# Altium project DiverStep_Test.PrjPCB
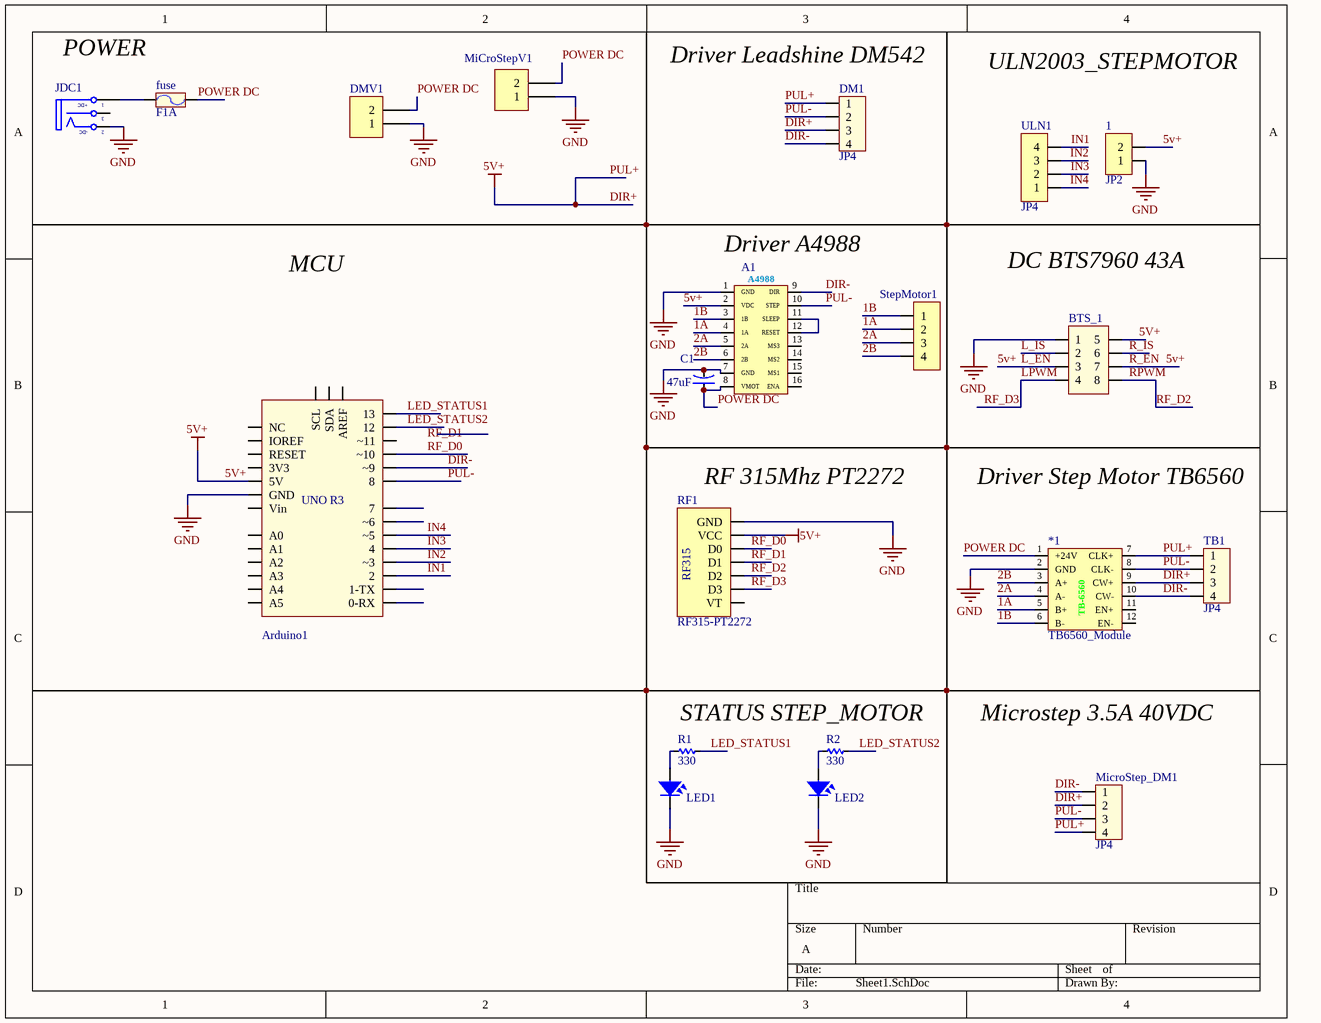
[diagram p0: Sheet1.SchDoc]
1 sheet, 20 parts. Net scope: global (net labels, ports and power ports of the same name join across sheets).
Board file: PCB1.PcbDoc

## Sheet Sheet1.SchDoc
size A

### Parts
1  JP2  [JP2-D1T]
*1  TB6560_Module  [TB6560_Module]
A1  A4988  [A4988]  (value not drawn)
Arduino1  Arduino Uno R3  [UNO_R3_NoCircle]  (value not drawn)
BTS_1  Connector 4x2  [JP4x2]  (value not drawn)
C1  47uF  [CA-ALU-2.54]
DM1  JP4  [CON4]
DMV1  KF2  [KF2-5.08]  (value not drawn)
fuse  F1A  [Fuse1]
JDC1  Jac DC  [DC0]  (value not drawn)
LED1  LED  [LED-3MM-RED]  (value not drawn)
LED2  LED  [LED-3MM-RED]  (value not drawn)
MicroStep_DM1  JP4  [CON4]
MiCroStepV1  KF2  [KF2-5.08]  (value not drawn)
R1  330  [RES-1/4W-SMALL]
R2  330  [RES-1/4W-SMALL]
RF1  RF315-PT2272  [RF_315]
StepMotor1  JP4  [JP4-C1T]  (value not drawn)
TB1  JP4  [CON4]
ULN1  JP4  [JP4-D1T]

### Nets
5V+: 1.2 *1.7(CLK+) *1.9(CW+) A1.2(VDC) Arduino1.5V BTS_1.3 BTS_1.5 BTS_1.7 DM1.1 DM1.3 MicroStep_DM1.2 MicroStep_DM1.4 RF1.6(VCC) TB1.1 TB1.3  [also labelled DIR+, L_EN, PUL+, R_EN]
GND: 1.1 *1.2(GND) A1.1(GND) A1.7(GND) Arduino1.GND BTS_1.1 C1.2 DMV1.1 JDC1.2(TN) LED1.2 LED2.2 MiCroStepV1.1 RF1.7(GND)
1A: *1.5(B+) A1.4(1A) StepMotor1.2
1B: *1.6(B-) A1.3(1B) StepMotor1.1
2A: *1.4(A-) A1.5(2A) StepMotor1.3
2B: *1.3(A+) A1.6(2B) StepMotor1.4
DIR-: *1.10(CW-) A1.9(DIR) Arduino1.~9 DM1.4 MicroStep_DM1.1 TB1.4
IN1: Arduino1.2 ULN1.4
IN2: Arduino1.~3 ULN1.3
IN3: Arduino1.4 ULN1.2
IN4: Arduino1.~5 ULN1.1
L_IS: BTS_1.2
LED_STATUS1: Arduino1.13 R1.1
LED_STATUS2: Arduino1.12 R2.1
LPWM: BTS_1.4 RF1.2(D3)  [also labelled RF_D3]
POWER DC: *1.1(+24V) A1.8(VMOT) C1.1 DMV1.2 fuse.2 MiCroStepV1.2
PUL-: *1.8(CLK-) A1.10(STEP) Arduino1.8 DM1.2 MicroStep_DM1.3 TB1.2
R_IS: BTS_1.6
RF_D0: Arduino1.~10 RF1.5(D0)
RF_D1: RF1.4(D1)
RF_D2: BTS_1.8 RF1.3(D2)  [also labelled RPWM]
NetA1_11: A1.11(SLEEP) A1.12(RESET)
Netfuse_1: fuse.1 JDC1.1(T)
NetLED1_1: LED1.1 R1.2
NetLED2_1: LED2.1 R2.2

Not connected (* = marked no-connect by the designer): *1 11(EN+) 12(EN-); A1 13(MS3) 14(MS2) 15(MS1) 16(ENA); Arduino1 0-RX 1-TX 3V3 7 A0 A1 A2 A3 A4 A5 AREF IOREF NC RESET SCL SDA Vin ~6 ~11; JDC1 3(S); RF1 1(VT)

### Notes on the sheet
- POWER
- (near DM1) Driver Leadshine DM542
- ULN2003_STEPMOTOR
- MCU
- (near A1) Driver A4988
- DC BTS7960 43A
- (near RF1) RF 315Mhz PT2272
- Driver Step Motor TB6560
- STATUS STEP_MOTOR
- Microstep 3.5A 40VDC
- Labels drawn without touching a wire or pin: RF_D1
- (in symbol Arduino Uno R3) UNO R3
- (in symbol DCIN) +DC; -DC
- (in symbol RF315-PT2272) RF315
- (in symbol TB6560_Module) TB-6560

### Library data of the parts
1 = JP2: WR-PHD 2.54 mm Angled Socket Header; Manufacturer: W¨¹rth Elektronik eiSos GmbH; partNo: 613002143121; ComponentLink1 Description: Manufacturer; ComponentLink2 Description: Datasheet; NoPins: 02; Created Date: 29 March 2013; ComponentLink1URL: http://www.we-online.com; ComponentLink2URL: http://katalog.we-online.de/em/datasheet/6130xx143121.pdf; Created by: Karrer Zheng
Arduino1 = Arduino Uno R3: Value: Cau 1A
BTS_1 = JP4x2: Value: Connector 4x2
C1 = CN-ALU-DIP: Capacitor (Semiconductor SIM Model); Value: 104; LatestRevisionDate: 17-Jul-2002; LatestRevisionNote: Re-released for DXP Platform.; PackageReference: C1206; Publisher: Altium Limited
DM1 MicroStep_DM1 TB1 = Con4: Connector 4; Value: Connector 4
DMV1 MiCroStepV1 = KF2: Manufacturer: Würth Elektronik eiSos GmbH; partNo: 691103110002; ComponentLink1 Description: Manufacturer; ComponentLink2 Description: Datasheet; NoPins: 2; Created Date: 29 October 2013; ComponentLink1URL: http://www.we-online.com; ComponentLink2URL: http://katalog.we-online.de/em/datasheet/6911031100xx.pdf; Created by: Karrer Zheng
fuse = Fuse: Designed by: VanDungEvn; Value: Fuse
JDC1 = DCIN: Jac DC input; Value: Jac DC
LED1 LED2 = LED: LED Single colour Green and Red; Value: LED 3 ly Single Colour
R1 R2 = Res: Manufacturer: Generic Components; Class: Passive; SubClass: R; Published: 08/06/2000; Publisher: Altium Hobart Technology Centre
RF1 = RF315-PT2272: Manufacturer: W¨¹rth Elektronik eiSos GmbH; partNo: 613004143121; ComponentLink1 Description: Manufacturer; ComponentLink2 Description: Datasheet; NoPins: 04; Created Date: 29 March 2013; ComponentLink1URL: http://www.we-online.com; ComponentLink2URL: http://katalog.we-online.de/em/datasheet/6130xx143121.pdf; Created by: Karrer Zheng
StepMotor1 ULN1 = JP4: WR-PHD 2.54 mm Angled Socket Header; Manufacturer: W¨¹rth Elektronik eiSos GmbH; partNo: 613004143121; ComponentLink1 Description: Manufacturer; ComponentLink2 Description: Datasheet; NoPins: 04; Created Date: 29 March 2013; ComponentLink1URL: http://www.we-online.com; ComponentLink2URL: http://katalog.we-online.de/em/datasheet/6130xx143121.pdf; Created by: Karrer Zheng